# EAGLE board Proto2 (EAGLE 8.5.1), part 1 of 2
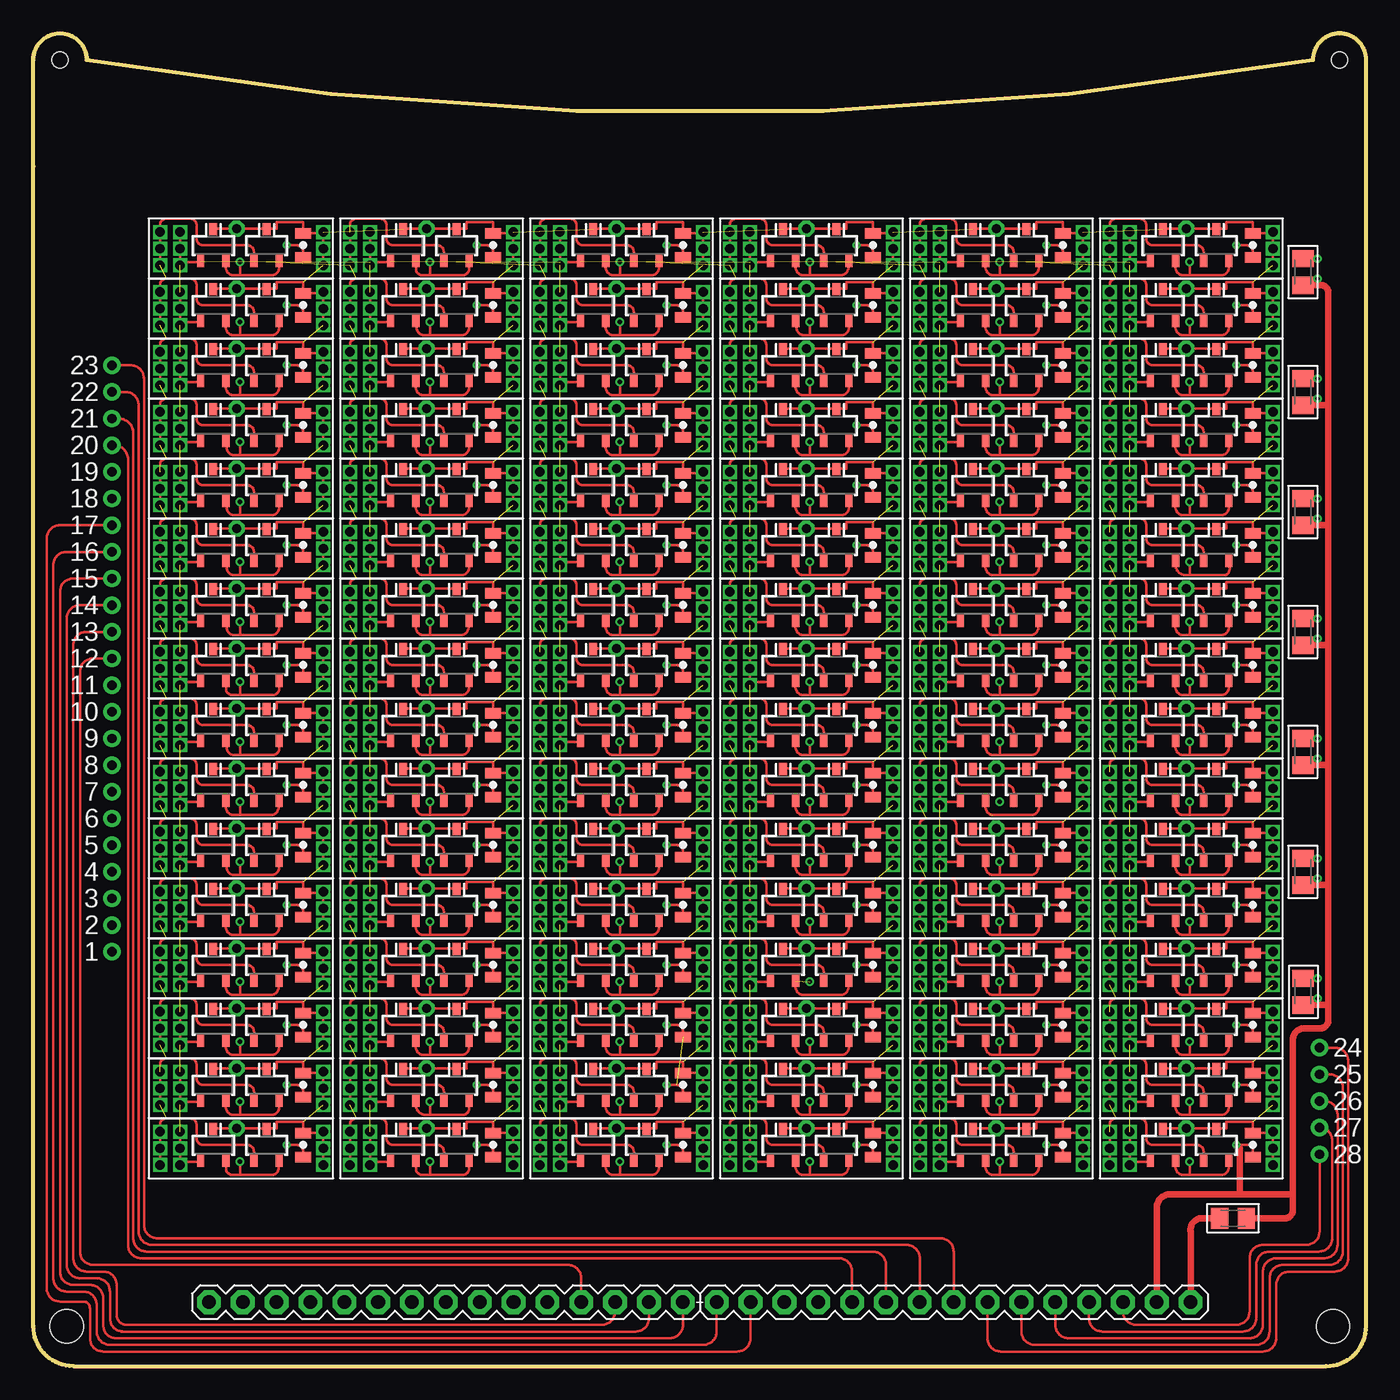
[diagram p1: board, top side]
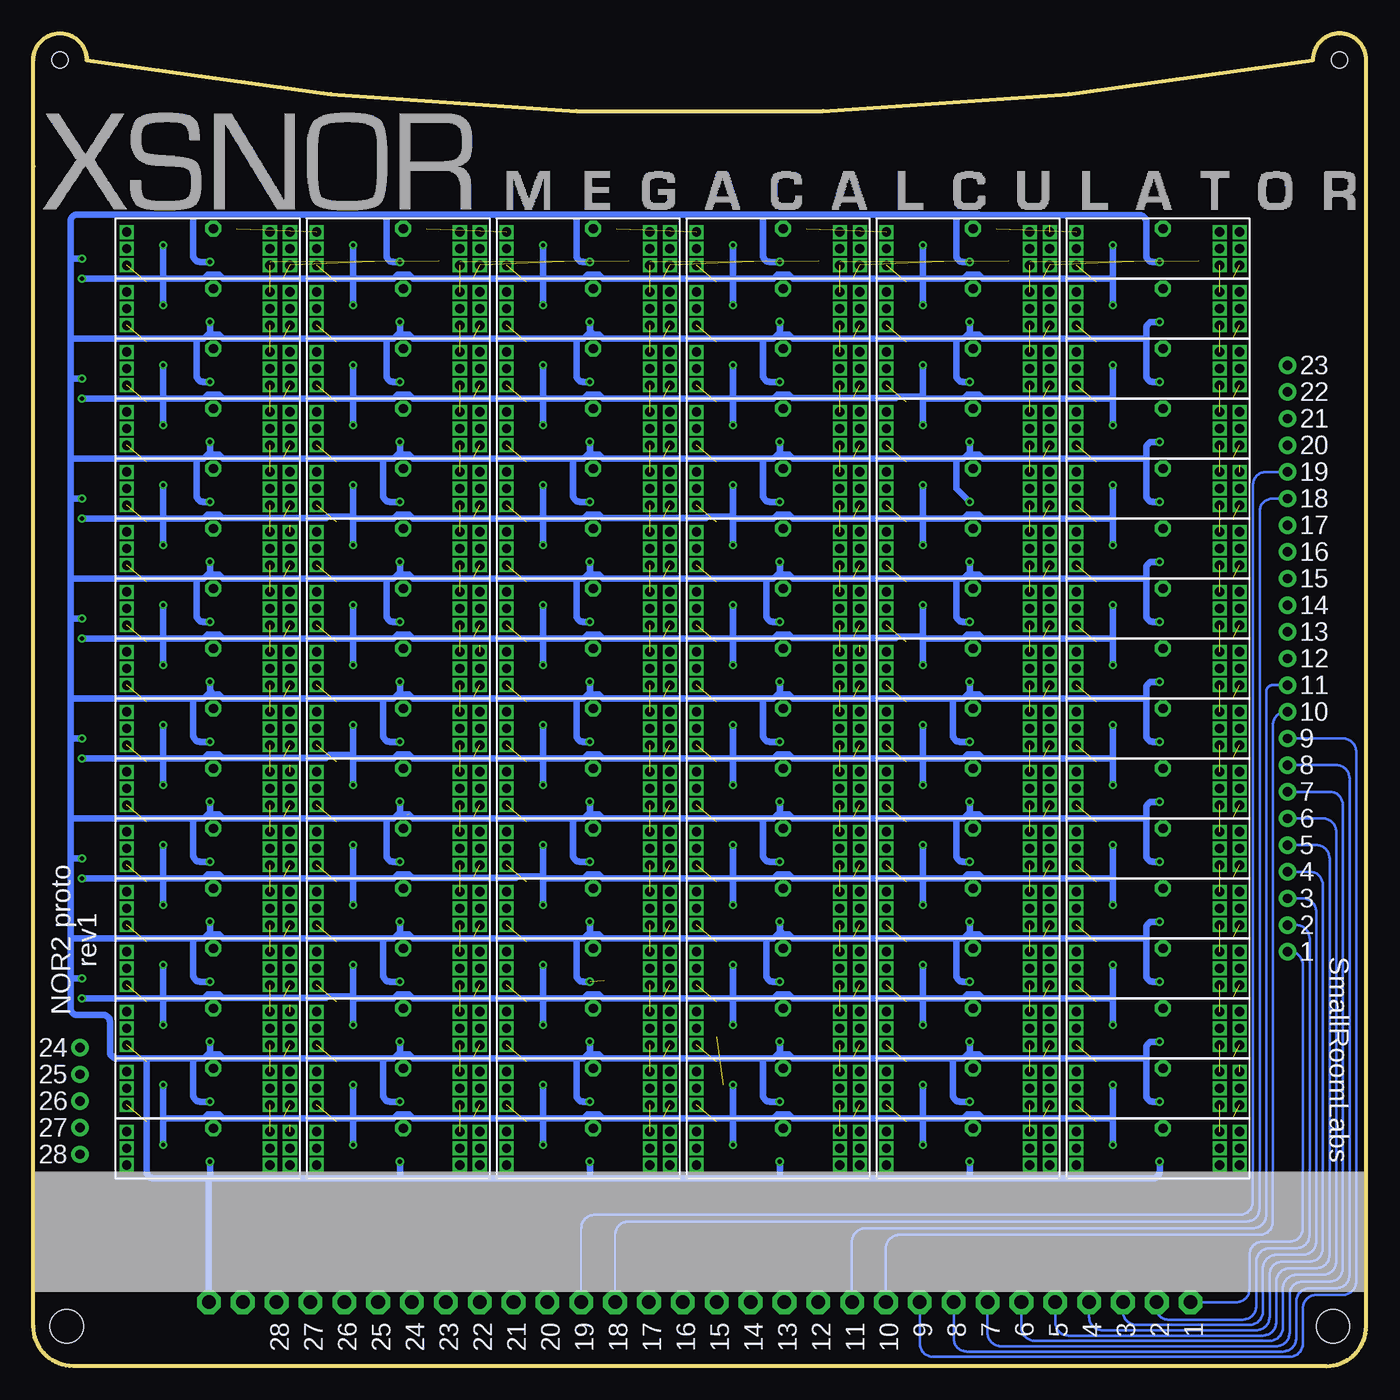
[diagram p2: board, bottom side, seen from below]

Size 100 x 100 mm. Coordinates in mm from the lower left corner, seen from the top.
Outline: 3,0 arc-90 0,3 0,90 0,98 arc-90 2,100 arc-90 4,98 arc20 96,98 arc-90 98,100 arc-90 100,98 100,90 100,3 arc-90 97,0 3,0
Copper layers (1*16): Top 0.035mm / dielectric 1.5mm / Bottom 0.035mm
Design rules "dirt_cheap_dirty_boards.v1": minimum track width 5mil, minimum drill 12mil, track to track 5mil, track to pad 5mil, pad to pad 5mil, via to via 5mil, smd to smd 0mil, copper to edge 10mil, drill to drill 10mil, minimum pad ring 10mil, minimum via ring 6mil, stop-mask expansion 2mil, vias tented up to drill 25mil, thermal gap 10mil
Net classes: 0 default: width 0.2 mm, drill 0.305 mm, clearance 0.2 mm
Holes 2.5 mm at 2.5,3 97.5,3
Holes 1.2 mm at 2,98 98,98

## Footprints (pad centres in the part's own frame; a part is rotated, then mirrored left to right if it is on the bottom)
C0805K = smd 1.3 x 1.6: 1 -1,0; 2 1,0
1X30 = drill 1.016 pad 1.778 octagon: 1 -36.83,0; 2 -34.29,0; 3 -31.75,0; 4 -29.21,0; 5 -26.67,0; 6 -24.13,0; 7 -21.59,0; 8 -19.05,0; 9 -16.51,0; 10 -13.97,0; 11 -11.43,0; 12 -8.89,0; 13 -6.35,0; 14 -3.81,0; 15 -1.27,0; 16 1.27,0; 17 3.81,0; 18 6.35,0; 19 8.89,0; 20 11.43,0; 21 13.97,0; 22 16.51,0; 23 19.05,0; 24 21.59,0; 25 24.13,0; 26 26.67,0; 27 29.21,0; 28 31.75,0; 29 34.29,0; 30 36.83,0
SOT23 = smd 0.6 x 0.9: 1 -0.95,-1.2; 2 0.95,-1.2 | smd 0.65 x 0.9: 3 0,1.2
0805 = smd 0.8 x 1.2: 1 -0.9,0; 2 0.9,0

## Placement (x,y rotation side)
C2  [C0805K]  90,11.1 180 top
C4  [C0805K]  95.25,28.1 90 top
C6  [C0805K]  95.25,37.1 90 top
C8  [C0805K]  95.25,46.1 90 top
C10  [C0805K]  95.25,55.1 90 top
C12  [C0805K]  95.25,64.1 90 top
C14  [C0805K]  95.25,73.1 90 top
C16  [C0805K]  95.25,82.1 90 top
JP2  [1X30]  50,4.8 0 top
Q1  310mA/60V/1.6Ω  [SOT23]  13.5,16.6 0 top
Q2  310mA/60V/1.6Ω  [SOT23]  17.5,16.6 0 top
Q5  310mA/60V/1.6Ω  [SOT23]  13.5,21.1 0 top
Q6  310mA/60V/1.6Ω  [SOT23]  17.5,21.1 0 top
Q9  310mA/60V/1.6Ω  [SOT23]  13.5,25.6 0 top
Q10  310mA/60V/1.6Ω  [SOT23]  17.5,25.6 0 top
Q13  310mA/60V/1.6Ω  [SOT23]  13.5,30.1 0 top
Q14  310mA/60V/1.6Ω  [SOT23]  17.5,30.1 0 top
Q17  310mA/60V/1.6Ω  [SOT23]  13.5,34.6 0 top
Q18  310mA/60V/1.6Ω  [SOT23]  17.5,34.6 0 top
Q21  310mA/60V/1.6Ω  [SOT23]  13.5,39.1 0 top
Q22  310mA/60V/1.6Ω  [SOT23]  17.5,39.1 0 top
Q25  310mA/60V/1.6Ω  [SOT23]  13.5,43.6 0 top
Q26  310mA/60V/1.6Ω  [SOT23]  17.5,43.6 0 top
Q29  310mA/60V/1.6Ω  [SOT23]  13.5,48.1 0 top
Q30  310mA/60V/1.6Ω  [SOT23]  17.5,48.1 0 top
Q33  310mA/60V/1.6Ω  [SOT23]  13.5,52.6 0 top
Q34  310mA/60V/1.6Ω  [SOT23]  17.5,52.6 0 top
Q37  310mA/60V/1.6Ω  [SOT23]  13.5,57.1 0 top
Q38  310mA/60V/1.6Ω  [SOT23]  17.5,57.1 0 top
Q41  310mA/60V/1.6Ω  [SOT23]  13.5,61.6 0 top
Q42  310mA/60V/1.6Ω  [SOT23]  17.5,61.6 0 top
Q45  310mA/60V/1.6Ω  [SOT23]  13.5,66.1 0 top
Q46  310mA/60V/1.6Ω  [SOT23]  17.5,66.1 0 top
Q49  310mA/60V/1.6Ω  [SOT23]  13.5,70.6 0 top
Q50  310mA/60V/1.6Ω  [SOT23]  17.5,70.6 0 top
Q53  310mA/60V/1.6Ω  [SOT23]  13.5,75.1 0 top
Q54  310mA/60V/1.6Ω  [SOT23]  17.5,75.1 0 top
Q57  310mA/60V/1.6Ω  [SOT23]  13.5,79.6 0 top
Q58  310mA/60V/1.6Ω  [SOT23]  17.5,79.6 0 top
Q61  310mA/60V/1.6Ω  [SOT23]  13.5,84.1 0 top
Q62  310mA/60V/1.6Ω  [SOT23]  17.5,84.1 0 top
Q65  310mA/60V/1.6Ω  [SOT23]  27.75,16.6 0 top
Q66  310mA/60V/1.6Ω  [SOT23]  31.75,16.6 0 top
Q67  310mA/60V/1.6Ω  [SOT23]  27.75,21.1 0 top
Q68  310mA/60V/1.6Ω  [SOT23]  31.75,21.1 0 top
Q69  310mA/60V/1.6Ω  [SOT23]  27.75,25.6 0 top
Q70  310mA/60V/1.6Ω  [SOT23]  31.75,25.6 0 top
Q71  310mA/60V/1.6Ω  [SOT23]  27.75,30.1 0 top
Q72  310mA/60V/1.6Ω  [SOT23]  31.75,30.1 0 top
Q73  310mA/60V/1.6Ω  [SOT23]  27.75,34.6 0 top
Q74  310mA/60V/1.6Ω  [SOT23]  31.75,34.6 0 top
Q75  310mA/60V/1.6Ω  [SOT23]  27.75,39.1 0 top
Q76  310mA/60V/1.6Ω  [SOT23]  31.75,39.1 0 top
Q77  310mA/60V/1.6Ω  [SOT23]  27.75,43.6 0 top
Q78  310mA/60V/1.6Ω  [SOT23]  31.75,43.6 0 top
Q79  310mA/60V/1.6Ω  [SOT23]  27.75,48.1 0 top
Q80  310mA/60V/1.6Ω  [SOT23]  31.75,48.1 0 top
Q81  310mA/60V/1.6Ω  [SOT23]  27.75,52.6 0 top
Q82  310mA/60V/1.6Ω  [SOT23]  31.75,52.6 0 top
Q83  310mA/60V/1.6Ω  [SOT23]  27.75,57.1 0 top
Q84  310mA/60V/1.6Ω  [SOT23]  31.75,57.1 0 top
Q85  310mA/60V/1.6Ω  [SOT23]  27.75,61.6 0 top
Q86  310mA/60V/1.6Ω  [SOT23]  31.75,61.6 0 top
Q87  310mA/60V/1.6Ω  [SOT23]  27.75,66.1 0 top
Q88  310mA/60V/1.6Ω  [SOT23]  31.75,66.1 0 top
Q89  310mA/60V/1.6Ω  [SOT23]  27.75,70.6 0 top
Q90  310mA/60V/1.6Ω  [SOT23]  31.75,70.6 0 top
Q91  310mA/60V/1.6Ω  [SOT23]  27.75,75.1 0 top
Q92  310mA/60V/1.6Ω  [SOT23]  31.75,75.1 0 top
Q93  310mA/60V/1.6Ω  [SOT23]  27.75,79.6 0 top
Q94  310mA/60V/1.6Ω  [SOT23]  31.75,79.6 0 top
Q95  310mA/60V/1.6Ω  [SOT23]  27.75,84.1 0 top
Q96  310mA/60V/1.6Ω  [SOT23]  31.75,84.1 0 top
Q129  310mA/60V/1.6Ω  [SOT23]  42,16.6 0 top
Q130  310mA/60V/1.6Ω  [SOT23]  46,16.6 0 top
Q131  310mA/60V/1.6Ω  [SOT23]  42,21.1 0 top
Q132  310mA/60V/1.6Ω  [SOT23]  46,21.1 0 top
Q133  310mA/60V/1.6Ω  [SOT23]  42,25.6 0 top
Q134  310mA/60V/1.6Ω  [SOT23]  46,25.6 0 top
Q135  310mA/60V/1.6Ω  [SOT23]  42,30.1 0 top
Q136  310mA/60V/1.6Ω  [SOT23]  46,30.1 0 top
Q137  310mA/60V/1.6Ω  [SOT23]  42,34.6 0 top
Q138  310mA/60V/1.6Ω  [SOT23]  46,34.6 0 top
Q139  310mA/60V/1.6Ω  [SOT23]  42,39.1 0 top
Q140  310mA/60V/1.6Ω  [SOT23]  46,39.1 0 top
Q141  310mA/60V/1.6Ω  [SOT23]  42,43.6 0 top
Q142  310mA/60V/1.6Ω  [SOT23]  46,43.6 0 top
Q143  310mA/60V/1.6Ω  [SOT23]  42,48.1 0 top
Q144  310mA/60V/1.6Ω  [SOT23]  46,48.1 0 top
Q145  310mA/60V/1.6Ω  [SOT23]  42,52.6 0 top
Q146  310mA/60V/1.6Ω  [SOT23]  46,52.6 0 top
Q147  310mA/60V/1.6Ω  [SOT23]  42,57.1 0 top
Q148  310mA/60V/1.6Ω  [SOT23]  46,57.1 0 top
Q149  310mA/60V/1.6Ω  [SOT23]  42,61.6 0 top
Q150  310mA/60V/1.6Ω  [SOT23]  46,61.6 0 top
Q151  310mA/60V/1.6Ω  [SOT23]  42,66.1 0 top
Q152  310mA/60V/1.6Ω  [SOT23]  46,66.1 0 top
Q153  310mA/60V/1.6Ω  [SOT23]  42,70.6 0 top
Q154  310mA/60V/1.6Ω  [SOT23]  46,70.6 0 top
Q155  310mA/60V/1.6Ω  [SOT23]  42,75.1 0 top
Q156  310mA/60V/1.6Ω  [SOT23]  46,75.1 0 top
Q157  310mA/60V/1.6Ω  [SOT23]  42,79.6 0 top
Q158  310mA/60V/1.6Ω  [SOT23]  46,79.6 0 top
Q159  310mA/60V/1.6Ω  [SOT23]  42,84.1 0 top
Q160  310mA/60V/1.6Ω  [SOT23]  46,84.1 0 top
Q193  310mA/60V/1.6Ω  [SOT23]  56.25,16.6 0 top
Q194  310mA/60V/1.6Ω  [SOT23]  60.25,16.6 0 top
Q195  310mA/60V/1.6Ω  [SOT23]  56.25,21.1 0 top
Q196  310mA/60V/1.6Ω  [SOT23]  60.25,21.1 0 top
Q197  310mA/60V/1.6Ω  [SOT23]  56.25,25.6 0 top
Q198  310mA/60V/1.6Ω  [SOT23]  60.25,25.6 0 top
Q199  310mA/60V/1.6Ω  [SOT23]  56.25,30.1 0 top
Q200  310mA/60V/1.6Ω  [SOT23]  60.25,30.1 0 top
Q201  310mA/60V/1.6Ω  [SOT23]  56.25,34.6 0 top
Q202  310mA/60V/1.6Ω  [SOT23]  60.25,34.6 0 top
Q203  310mA/60V/1.6Ω  [SOT23]  56.25,39.1 0 top
Q204  310mA/60V/1.6Ω  [SOT23]  60.25,39.1 0 top
Q205  310mA/60V/1.6Ω  [SOT23]  56.25,43.6 0 top
Q206  310mA/60V/1.6Ω  [SOT23]  60.25,43.6 0 top
Q207  310mA/60V/1.6Ω  [SOT23]  56.25,48.1 0 top
Q208  310mA/60V/1.6Ω  [SOT23]  60.25,48.1 0 top
Q209  310mA/60V/1.6Ω  [SOT23]  56.25,52.6 0 top
Q210  310mA/60V/1.6Ω  [SOT23]  60.25,52.6 0 top
Q211  310mA/60V/1.6Ω  [SOT23]  56.25,57.1 0 top
Q212  310mA/60V/1.6Ω  [SOT23]  60.25,57.1 0 top
Q213  310mA/60V/1.6Ω  [SOT23]  56.25,61.6 0 top
Q214  310mA/60V/1.6Ω  [SOT23]  60.25,61.6 0 top
Q215  310mA/60V/1.6Ω  [SOT23]  56.25,66.1 0 top
Q216  310mA/60V/1.6Ω  [SOT23]  60.25,66.1 0 top
Q217  310mA/60V/1.6Ω  [SOT23]  56.25,70.6 0 top
Q218  310mA/60V/1.6Ω  [SOT23]  60.25,70.6 0 top
Q219  310mA/60V/1.6Ω  [SOT23]  56.25,75.1 0 top
Q220  310mA/60V/1.6Ω  [SOT23]  60.25,75.1 0 top
Q221  310mA/60V/1.6Ω  [SOT23]  56.25,79.6 0 top
Q222  310mA/60V/1.6Ω  [SOT23]  60.25,79.6 0 top
Q223  310mA/60V/1.6Ω  [SOT23]  56.25,84.1 0 top
Q224  310mA/60V/1.6Ω  [SOT23]  60.25,84.1 0 top
Q257  310mA/60V/1.6Ω  [SOT23]  70.5,16.6 0 top
Q258  310mA/60V/1.6Ω  [SOT23]  74.5,16.6 0 top
Q259  310mA/60V/1.6Ω  [SOT23]  70.5,21.1 0 top
Q260  310mA/60V/1.6Ω  [SOT23]  74.5,21.1 0 top
Q261  310mA/60V/1.6Ω  [SOT23]  70.5,25.6 0 top
Q262  310mA/60V/1.6Ω  [SOT23]  74.5,25.6 0 top
Q263  310mA/60V/1.6Ω  [SOT23]  70.5,30.1 0 top
Q264  310mA/60V/1.6Ω  [SOT23]  74.5,30.1 0 top
Q265  310mA/60V/1.6Ω  [SOT23]  70.5,34.6 0 top
Q266  310mA/60V/1.6Ω  [SOT23]  74.5,34.6 0 top
Q267  310mA/60V/1.6Ω  [SOT23]  70.5,39.1 0 top
Q268  310mA/60V/1.6Ω  [SOT23]  74.5,39.1 0 top
Q269  310mA/60V/1.6Ω  [SOT23]  70.5,43.6 0 top
Q270  310mA/60V/1.6Ω  [SOT23]  74.5,43.6 0 top
Q271  310mA/60V/1.6Ω  [SOT23]  70.5,48.1 0 top
Q272  310mA/60V/1.6Ω  [SOT23]  74.5,48.1 0 top
Q273  310mA/60V/1.6Ω  [SOT23]  70.5,52.6 0 top
Q274  310mA/60V/1.6Ω  [SOT23]  74.5,52.6 0 top
Q275  310mA/60V/1.6Ω  [SOT23]  70.5,57.1 0 top
Q276  310mA/60V/1.6Ω  [SOT23]  74.5,57.1 0 top
Q277  310mA/60V/1.6Ω  [SOT23]  70.5,61.6 0 top
Q278  310mA/60V/1.6Ω  [SOT23]  74.5,61.6 0 top
Q279  310mA/60V/1.6Ω  [SOT23]  70.5,66.1 0 top
Q280  310mA/60V/1.6Ω  [SOT23]  74.5,66.1 0 top
Q281  310mA/60V/1.6Ω  [SOT23]  70.5,70.6 0 top
Q282  310mA/60V/1.6Ω  [SOT23]  74.5,70.6 0 top
Q283  310mA/60V/1.6Ω  [SOT23]  70.5,75.1 0 top
Q284  310mA/60V/1.6Ω  [SOT23]  74.5,75.1 0 top
Q285  310mA/60V/1.6Ω  [SOT23]  70.5,79.6 0 top
Q286  310mA/60V/1.6Ω  [SOT23]  74.5,79.6 0 top
Q287  310mA/60V/1.6Ω  [SOT23]  70.5,84.1 0 top
Q288  310mA/60V/1.6Ω  [SOT23]  74.5,84.1 0 top
Q321  310mA/60V/1.6Ω  [SOT23]  84.75,16.6 0 top
Q322  310mA/60V/1.6Ω  [SOT23]  88.75,16.6 0 top
Q323  310mA/60V/1.6Ω  [SOT23]  84.75,21.1 0 top
Q324  310mA/60V/1.6Ω  [SOT23]  88.75,21.1 0 top
Q325  310mA/60V/1.6Ω  [SOT23]  84.75,25.6 0 top
Q326  310mA/60V/1.6Ω  [SOT23]  88.75,25.6 0 top
Q327  310mA/60V/1.6Ω  [SOT23]  84.75,30.1 0 top
Q328  310mA/60V/1.6Ω  [SOT23]  88.75,30.1 0 top
Q329  310mA/60V/1.6Ω  [SOT23]  84.75,34.6 0 top
Q330  310mA/60V/1.6Ω  [SOT23]  88.75,34.6 0 top
Q331  310mA/60V/1.6Ω  [SOT23]  84.75,39.1 0 top
Q332  310mA/60V/1.6Ω  [SOT23]  88.75,39.1 0 top
Q333  310mA/60V/1.6Ω  [SOT23]  84.75,43.6 0 top
Q334  310mA/60V/1.6Ω  [SOT23]  88.75,43.6 0 top
Q335  310mA/60V/1.6Ω  [SOT23]  84.75,48.1 0 top
Q336  310mA/60V/1.6Ω  [SOT23]  88.75,48.1 0 top
Q337  310mA/60V/1.6Ω  [SOT23]  84.75,52.6 0 top
Q338  310mA/60V/1.6Ω  [SOT23]  88.75,52.6 0 top
Q339  310mA/60V/1.6Ω  [SOT23]  84.75,57.1 0 top
Q340  310mA/60V/1.6Ω  [SOT23]  88.75,57.1 0 top
Q341  310mA/60V/1.6Ω  [SOT23]  84.75,61.6 0 top
Q342  310mA/60V/1.6Ω  [SOT23]  88.75,61.6 0 top
Q343  310mA/60V/1.6Ω  [SOT23]  84.75,66.1 0 top
Q344  310mA/60V/1.6Ω  [SOT23]  88.75,66.1 0 top
Q345  310mA/60V/1.6Ω  [SOT23]  84.75,70.6 0 top
Q346  310mA/60V/1.6Ω  [SOT23]  88.75,70.6 0 top
Q347  310mA/60V/1.6Ω  [SOT23]  84.75,75.1 0 top
Q348  310mA/60V/1.6Ω  [SOT23]  88.75,75.1 0 top
Q349  310mA/60V/1.6Ω  [SOT23]  84.75,79.6 0 top
Q350  310mA/60V/1.6Ω  [SOT23]  88.75,79.6 0 top
Q351  310mA/60V/1.6Ω  [SOT23]  84.75,84.1 0 top
Q352  310mA/60V/1.6Ω  [SOT23]  88.75,84.1 0 top
R1  [0805]  20.25,16.6 90 top
R3  [0805]  20.25,21.1 90 top
R5  [0805]  20.25,25.6 90 top
R7  [0805]  20.25,30.1 90 top
R9  [0805]  20.25,34.6 90 top
R11  [0805]  20.25,39.1 90 top
R13  [0805]  20.25,43.6 90 top
R15  [0805]  20.25,48.1 90 top
R17  [0805]  20.25,52.6 90 top
R19  [0805]  20.25,57.1 90 top
R21  [0805]  20.25,61.6 90 top
R23  [0805]  20.25,66.1 90 top
R25  [0805]  20.25,70.6 90 top
R27  [0805]  20.25,75.1 90 top
R29  [0805]  20.25,79.6 90 top
R31  [0805]  20.25,84.1 90 top
R33  [0805]  34.5,16.6 90 top
R34  [0805]  34.5,21.1 90 top
R35  [0805]  34.5,25.6 90 top
R36  [0805]  34.5,30.1 90 top
R37  [0805]  34.5,34.6 90 top
R38  [0805]  34.5,39.1 90 top
R39  [0805]  34.5,43.6 90 top
R40  [0805]  34.5,48.1 90 top
R41  [0805]  34.5,52.6 90 top
R42  [0805]  34.5,57.1 90 top
R43  [0805]  34.5,61.6 90 top
R44  [0805]  34.5,66.1 90 top
R45  [0805]  34.5,70.6 90 top
R46  [0805]  34.5,75.1 90 top
R47  [0805]  34.5,79.6 90 top
R48  [0805]  34.5,84.1 90 top
R65  [0805]  48.75,16.6 90 top
R66  [0805]  48.75,21.1 90 top
R67  [0805]  48.75,25.6 90 top
R68  [0805]  48.75,30.1 90 top
R69  [0805]  48.75,34.6 90 top
R70  [0805]  48.75,39.1 90 top
R71  [0805]  48.75,43.6 90 top
R72  [0805]  48.75,48.1 90 top
R73  [0805]  48.75,52.6 90 top
R74  [0805]  48.75,57.1 90 top
R75  [0805]  48.75,61.6 90 top
R76  [0805]  48.75,66.1 90 top
R77  [0805]  48.75,70.6 90 top
R78  [0805]  48.75,75.1 90 top
R79  [0805]  48.75,79.6 90 top
R80  [0805]  48.75,84.1 90 top
R97  [0805]  63,16.6 90 top
R98  [0805]  63,21.1 90 top
R99  [0805]  63,25.6 90 top
R100  [0805]  63,30.1 90 top
R101  [0805]  63,34.6 90 top
R102  [0805]  63,39.1 90 top
R103  [0805]  63,43.6 90 top
R104  [0805]  63,48.1 90 top
R105  [0805]  63,52.6 90 top
R106  [0805]  63,57.1 90 top
R107  [0805]  63,61.6 90 top
R108  [0805]  63,66.1 90 top
R109  [0805]  63,70.6 90 top
R110  [0805]  63,75.1 90 top
R111  [0805]  63,79.6 90 top
R112  [0805]  63,84.1 90 top
R129  [0805]  77.25,16.6 90 top
R130  [0805]  77.25,21.1 90 top
R131  [0805]  77.25,25.6 90 top
R132  [0805]  77.25,30.1 90 top
R133  [0805]  77.25,34.6 90 top
R134  [0805]  77.25,39.1 90 top
R135  [0805]  77.25,43.6 90 top
R136  [0805]  77.25,48.1 90 top
R137  [0805]  77.25,52.6 90 top
R138  [0805]  77.25,57.1 90 top
R139  [0805]  77.25,61.6 90 top
R140  [0805]  77.25,66.1 90 top
R141  [0805]  77.25,70.6 90 top
R142  [0805]  77.25,75.1 90 top
R143  [0805]  77.25,79.6 90 top
R144  [0805]  77.25,84.1 90 top
R161  [0805]  91.5,16.6 90 top
R162  [0805]  91.5,21.1 90 top
R163  [0805]  91.5,25.6 90 top
R164  [0805]  91.5,30.1 90 top
R165  [0805]  91.5,34.6 90 top
R166  [0805]  91.5,39.1 90 top
R167  [0805]  91.5,43.6 90 top
R168  [0805]  91.5,48.1 90 top
R169  [0805]  91.5,52.6 90 top
R170  [0805]  91.5,57.1 90 top
R171  [0805]  91.5,61.6 90 top
R172  [0805]  91.5,66.1 90 top
R173  [0805]  91.5,70.6 90 top
R174  [0805]  91.5,75.1 90 top
R175  [0805]  91.5,79.6 90 top
R176  [0805]  91.5,84.1 90 top

## Tracks (layer width: path | path; a pad name or v marks a point on that pad's centre or on a via)
GND  (via drill 0.3)  (2 unrouted)
  Top 0.2: Q2.2 18.4,15.35 18.4,14.85 arc-90 17.9,14.35 15.5,14.35 | Q14.2 18.4,28.85 18.4,28.6 arc-90 17.9,27.85 15.5,27.85 | Q21.2 14.5,37.9 14.5,37.6 arc90 15,36.85 15.5,36.85 | Q26.2 18.4,42.35 18.4,42.1 arc-90 17.9,41.35 15.5,41.35 | Q29.2 14.5,46.9 14.5,46.6 arc90 15,45.85 15.5,45.85 | Q37.2 14.5,55.9 14.5,55.6 arc90 15,54.85 15.5,54.85 | Q41.2 14.5,60.4 14.5,60.1 arc90 15,59.35 15.5,59.35 | Q45.2 14.5,64.9 14.5,64.6 arc90 15,63.85 15.5,63.85 | Q49.2 14.5,69.4 14.5,69.1 arc90 15,68.35 15.5,68.35 | Q72.2 32.65,28.85 32.65,28.6 arc-90 32.15,27.85 29.75,27.85 | Q84.2 32.65,55.85 32.65,55.6 arc-90 32.15,54.85 29.75,54.85 | Q93.2 28.75,78.4 28.75,78.1 arc90 29.25,77.35 29.75,77.35 | Q136.2 46.9,28.85 46.9,28.6 arc-90 46.4,27.85 44,27.85 | Q194.2 61.15,15.35 61.15,15.1 arc-90 60.65,14.35 58.25,14.35 | Q200.2 61.15,28.85 61.15,28.6 arc-90 60.65,27.85 57.7,27.85 arc-90 57.2,28.6 Q199.2 | Q221.2 57.25,78.4 57.25,78.1 arc90 57.75,77.35 58.25,77.35 | Q224.2 61.15,82.85 61.15,82.6 arc-90 60.65,81.85 58.25,81.85 | Q268.2 75.4,37.85 75.4,37.6 arc-90 74.9,36.85 72.5,36.85 | Q276.2 75.4,55.85 75.4,55.6 arc-90 74.9,54.85 72.5,54.85 | Q280.2 75.4,64.85 75.4,64.6 arc-90 74.9,63.85 72.5,63.85 | Q5.2 14.45,19.6 arc90 14.95,18.85 15.5,18.85 | Q6.2 18.45,19.6 arc-90 17.95,18.85 15.5,18.85 | Q9.2 14.45,24.1 arc90 14.95,23.35 15.5,23.35 | Q10.2 18.45,24.1 arc-90 17.95,23.35 15.5,23.35 | Q13.2 14.45,28.6 arc90 14.95,27.85 15.5,27.85 | Q17.2 14.45,33.1 arc90 14.95,32.35 15.5,32.35 | Q18.2 18.45,33.1 arc-90 17.95,32.35 15.5,32.35 | Q22.2 18.45,37.6 arc-90 17.95,36.85 15.5,36.85 | Q25.2 14.45,42.1 arc90 14.95,41.35 15.5,41.35
  Top 0.2: Q30.2 18.45,46.35 arc-90 17.95,45.85 15.5,45.85 | Q34.2 18.45,50.85 arc-90 17.95,50.35 15.5,50.35 | Q33.2 14.45,50.85 arc90 14.95,50.35 15.5,50.35 | Q1.2 14.45,14.85 arc90 14.95,14.35 15.5,14.35 | Q38.2 18.45,55.6 arc-90 17.95,54.85 15.5,54.85 | Q42.2 18.45,60.1 arc-90 17.95,59.35 15.5,59.35 | Q46.2 18.45,64.6 arc-90 17.95,63.85 15.5,63.85 | Q50.2 18.45,69.1 arc-90 17.95,68.35 15.5,68.35 | Q53.2 14.45,73.6 arc90 14.95,72.85 15.5,72.85 | Q54.2 18.45,73.6 arc-90 17.95,72.85 15.5,72.85 | Q57.2 14.45,78.1 arc90 14.95,77.35 15.5,77.35 | Q58.2 18.45,78.1 arc-90 17.95,77.35 15.5,77.35 | Q62.2 18.45,82.6 arc-90 17.95,81.85 15.5,81.85 | Q61.2 14.45,82.6 arc90 14.95,81.85 15.5,81.85 | 28.7,82.6 Q95.2 28.7,82.35 arc90 29.2,81.85 29.75,81.85 | Q94.2 32.7,78.1 arc-90 32.2,77.35 29.75,77.35 | Q91.2 28.7,73.6 arc90 29.2,72.85 29.75,72.85 | Q92.2 32.7,73.6 arc-90 32.2,72.85 29.75,72.85 | Q90.2 32.7,69.1 arc-90 32.2,68.35 29.75,68.35 | Q89.2 28.7,69.1 arc90 29.2,68.35 29.75,68.35 | Q87.2 28.7,64.6 arc90 29.2,63.85 29.75,63.85 | Q88.2 32.7,64.6 arc-90 32.2,63.85 29.75,63.85 | Q86.2 32.7,60.1 arc-90 32.2,59.35 29.75,59.35 | Q85.2 28.7,60.1 arc90 29.2,59.35 29.75,59.35 | Q83.2 28.7,55.6 arc90 29.2,54.85 29.75,54.85 | Q81.2 28.7,51.1 arc90 29.2,50.35 29.75,50.35 | Q82.2 32.7,51.1 arc-90 32.2,50.35 29.75,50.35 | Q79.2 28.7,46.6 arc90 29.2,45.85 29.75,45.85 | Q80.2 32.7,46.6 arc-90 32.2,45.85 29.75,45.85 | Q77.2 28.7,42.1 arc90 29.2,41.35 29.75,41.35 | Q78.2 32.7,42.1 arc-90 32.2,41.35 29.75,41.35 | Q75.2 28.7,37.6 arc90 29.2,36.85 29.75,36.85 | Q76.2 32.7,37.6 arc-90 32.2,36.85 29.75,36.85 | Q73.2 28.7,33.1 arc90 29.2,32.35 29.75,32.35
  Top 0.2: Q74.2 32.7,33.1 arc-90 32.2,32.35 29.75,32.35 | Q71.2 28.7,28.6 arc90 29.2,27.85 29.75,27.85 | Q70.2 32.7,24.1 arc-90 32.2,23.35 29.75,23.35 | Q69.2 28.7,24.1 arc90 29.2,23.35 29.75,23.35 | Q67.2 28.7,19.6 arc90 29.45,18.85 29.75,18.85 | 29.75,18.85 32.2,18.85 arc90 32.7,19.35 Q68.2 | Q66.2 32.7,14.85 arc-90 32.2,14.35 29.75,14.35 | Q65.2 28.7,14.85 arc90 29.2,14.35 29.75,14.35 | 29.75,81.85 32.2,81.85 arc90 32.7,82.35 Q96.2 | Q159.2 42.95,82.6 arc90 43.45,81.85 44,81.85 | Q160.2 46.95,82.6 arc-90 46.45,81.85 44,81.85 | Q157.2 42.95,78.1 arc90 43.45,77.35 44,77.35 | Q158.2 46.95,78.1 arc-90 46.45,77.35 44,77.35 | Q155.2 42.95,73.6 arc90 43.45,72.85 44,72.85 | Q156.2 46.95,73.6 arc-90 46.45,72.85 44,72.85 | Q154.2 46.95,69.1 arc-90 46.45,68.35 44,68.35 | Q153.2 42.95,69.1 arc90 43.45,68.35 44,68.35 | Q151.2 42.95,64.6 arc90 43.45,63.85 44,63.85 | Q152.2 46.95,64.6 arc-90 46.45,63.85 44,63.85 | Q149.2 42.95,60.1 arc90 43.45,59.35 44,59.35 | Q150.2 46.95,60.1 arc-90 46.45,59.35 44,59.35 | Q147.2 42.95,55.6 arc90 43.45,54.85 44,54.85 | Q148.2 46.95,55.6 arc-90 46.45,54.85 44,54.85 | Q145.2 42.95,51.1 arc90 43.45,50.35 44,50.35 | Q146.2 46.95,51.1 arc-90 46.45,50.35 44,50.35 | Q143.2 42.95,46.6 arc90 43.45,45.85 44,45.85 | Q144.2 46.95,46.6 arc-90 46.45,45.85 44,45.85 | Q141.2 42.95,42.1 arc90 43.45,41.35 44,41.35 | Q142.2 46.95,42.1 arc-90 46.45,41.35 44,41.35 | Q139.2 42.95,37.6 arc90 43.45,36.85 44,36.85 | Q140.2 46.95,37.6 arc-90 46.45,36.85 44,36.85 | Q137.2 42.95,33.1 arc90 43.45,32.35 44,32.35 | Q138.2 46.95,33.1 arc-90 46.45,32.35 44,32.35 | Q135.2 42.95,28.6 arc90 43.45,27.85 44,27.85
  Top 0.2: Q133.2 42.95,24.1 arc90 43.45,23.35 44,23.35 | Q134.2 46.95,24.1 arc-90 46.45,23.35 44,23.35 | Q131.2 42.95,19.6 arc90 43.45,18.85 44,18.85 | Q132.2 46.95,19.6 arc-90 46.45,18.85 44,18.85 | Q129.2 42.95,15.1 arc90 43.45,14.35 44,14.35 | Q130.2 46.95,15.1 arc-90 46.45,14.35 44,14.35 | Q223.2 57.2,82.6 arc90 57.7,81.85 58.25,81.85 | Q222.2 61.2,78.1 arc-90 60.7,77.35 58.25,77.35 | Q219.2 57.2,73.6 arc90 57.7,72.85 58.25,72.85 | Q220.2 61.2,73.6 arc-90 60.7,72.85 58.25,72.85 | Q217.2 57.2,69.1 arc90 57.7,68.35 58.25,68.35 | Q218.2 61.2,69.1 arc-90 60.7,68.35 58.25,68.35 | Q215.2 57.2,64.6 arc90 57.7,63.85 58.25,63.85 | Q216.2 61.2,64.6 arc-90 60.7,63.85 58.25,63.85 | Q213.2 57.2,60.1 arc90 57.7,59.35 58.25,59.35 | Q214.2 61.2,60.1 arc-90 60.7,59.35 58.25,59.35 | Q211.2 57.2,55.6 arc90 57.7,54.85 58.25,54.85 | Q212.2 61.2,55.6 arc-90 60.7,54.85 58.25,54.85 | Q209.2 57.2,51.1 arc90 57.7,50.35 58.25,50.35 | Q210.2 61.2,51.1 arc-90 60.7,50.35 58.25,50.35 | Q207.2 57.2,46.6 arc90 57.7,45.85 58.25,45.85 | Q208.2 61.2,46.6 arc-90 60.7,45.85 58.25,45.85 | Q206.2 61.2,42.1 arc-90 60.7,41.35 58.25,41.35 | Q205.2 57.2,42.1 arc90 57.7,41.35 58.25,41.35 | Q203.2 57.2,37.6 arc90 57.7,36.85 58.25,36.85 | Q204.2 61.2,37.6 arc-90 60.7,36.85 58.25,36.85 | Q202.2 61.2,33.1 arc-90 60.7,32.35 58.25,32.35 | Q201.2 57.2,33.1 arc90 57.7,32.35 58.25,32.35 | Q197.2 57.2,24.1 arc90 57.7,23.35 58.25,23.35 | Q198.2 61.2,24.1 arc-90 60.7,23.35 58.25,23.35 | Q195.2 57.2,19.6 arc90 57.7,18.85 58.25,18.85 | Q196.2 61.2,19.6 arc-90 60.7,18.85 58.25,18.85 | Q193.2 57.2,15.1 arc90 57.7,14.35 58.25,14.35 | Q288.2 75.45,82.6 arc-90 74.95,81.85 72.5,81.85
  Top 0.2: Q287.2 71.45,82.6 arc90 71.95,81.85 72.5,81.85 | Q286.2 75.45,78.1 arc-90 74.95,77.35 72.5,77.35 | Q285.2 71.45,78.1 arc90 71.95,77.35 72.5,77.35 | Q283.2 71.45,73.6 arc90 71.95,72.85 72.5,72.85 | Q284.2 75.45,73.6 arc-90 74.95,72.85 72.5,72.85 | Q281.2 71.45,69.1 arc90 71.95,68.35 72.5,68.35 | Q282.2 75.45,69.1 arc-90 74.95,68.35 72.5,68.35 | Q279.2 71.45,64.6 arc90 71.95,63.85 72.5,63.85 | Q278.2 75.45,60.1 arc-90 74.95,59.35 72.5,59.35 | Q277.2 71.45,60.1 arc90 71.95,59.35 72.5,59.35 | Q275.2 71.45,55.6 arc90 71.95,54.85 72.5,54.85 | Q273.2 71.45,51.1 arc90 71.95,50.35 72.5,50.35 | Q274.2 75.45,51.1 arc-90 74.95,50.35 72.5,50.35 | Q272.2 75.45,46.6 arc-90 74.95,45.85 72.5,45.85 | Q271.2 71.45,46.6 arc90 71.95,45.85 72.5,45.85 | Q270.2 75.45,42.1 arc-90 74.95,41.35 71.95,41.35 arc-90 71.45,42.1 Q269.2 | Q267.2 71.45,37.6 arc90 71.95,36.85 72.5,36.85 | Q266.2 75.45,33.1 arc-90 74.95,32.35 72.5,32.35 | Q265.2 71.45,33.1 arc90 71.95,32.35 72.5,32.35 | Q264.2 75.45,28.6 arc-90 74.95,27.85 72.5,27.85 | Q263.2 71.45,28.6 arc90 71.95,27.85 72.5,27.85 | Q262.2 75.45,24.1 arc-90 74.95,23.35 72.5,23.35 | Q261.2 71.45,24.1 arc90 71.95,23.35 72.5,23.35 | Q259.2 71.45,19.6 arc90 71.95,18.85 72.5,18.85 | Q260.2 75.45,19.6 arc-90 74.95,18.85 72.5,18.85 | Q257.2 71.45,15.1 arc90 71.95,14.35 72.5,14.35 | Q258.2 75.45,15.1 arc-90 74.95,14.35 72.5,14.35 | Q351.2 85.7,82.6 arc90 86.2,81.85 86.75,81.85 | Q352.2 89.7,82.6 arc-90 89.2,81.85 86.75,81.85 | Q350.2 89.7,78.1 arc-90 89.2,77.35 86.75,77.35 | Q349.2 85.7,78.1 arc90 86.2,77.35 86.75,77.35 | Q348.2 89.7,73.6 arc-90 89.2,72.85 86.75,72.85
  Top 0.2: Q347.2 85.7,73.6 arc90 86.2,72.85 86.75,72.85 | Q345.2 85.7,69.1 arc90 86.2,68.35 86.75,68.35 | Q346.2 89.7,69.1 arc-90 89.2,68.35 86.75,68.35 | Q343.2 85.7,64.6 arc90 86.2,63.85 86.75,63.85 | Q344.2 89.7,64.6 arc-90 89.2,63.85 86.75,63.85 | Q342.2 89.7,60.1 arc-90 89.45,59.35 86.75,59.35 | Q341.2 85.7,60.1 arc90 86.45,59.35 86.75,59.35 | Q339.2 85.7,55.6 arc90 86.2,54.85 86.75,54.85 | Q340.2 89.7,55.6 arc-90 89.2,54.85 86.75,54.85 | Q338.2 89.7,51.1 arc-90 89.2,50.35 86.75,50.35 | Q337.2 85.7,51.1 arc90 86.2,50.35 86.75,50.35 | Q335.2 85.7,46.6 arc90 86.2,45.85 86.75,45.85 | Q336.2 89.7,46.6 arc-90 89.2,45.85 86.75,45.85 | Q334.2 89.7,42.1 arc-90 89.2,41.35 86.75,41.35 | Q333.2 85.7,42.1 arc90 86.2,41.35 86.75,41.35 | Q332.2 89.7,37.6 arc-90 89.2,36.85 86.75,36.85 | Q331.2 85.7,37.6 arc90 86.2,36.85 86.75,36.85 | Q329.2 85.7,33.1 arc90 86.2,32.35 86.75,32.35 | Q330.2 89.7,33.1 arc-90 89.2,32.35 86.75,32.35 | Q328.2 89.7,28.6 arc-90 89.2,27.85 86.75,27.85 | Q327.2 85.7,28.6 arc90 86.2,27.85 86.75,27.85 | Q325.2 85.7,24.1 arc90 86.2,23.35 86.75,23.35 | Q326.2 89.7,24.1 arc-90 89.2,23.35 86.75,23.35 | Q324.2 89.7,19.6 arc-90 89.2,18.85 86.75,18.85 | Q323.2 85.7,19.6 arc90 86.2,18.85 86.75,18.85 | Q322.2 89.7,15.1 arc-90 89.2,14.35 86.75,14.35 | Q321.2 85.7,15.1 arc90 86.2,14.35 86.75,14.35 | v15.5,82.85 15.5,81.85 | v15.5,78.35 15.5,77.35 | v15.5,73.85 15.5,72.85 | v15.5,69.35 15.5,68.35 | v15.5,64.85 15.5,63.85 | v15.5,60.35 15.5,59.35 | v15.5,55.85 15.5,54.85 | v15.5,51.35 15.5,50.35 | v15.5,46.85 15.5,45.85 | v15.5,42.35 15.5,41.35 | v15.5,37.85 15.5,36.85 | v15.5,33.35 15.5,32.35 | v15.5,28.85 15.5,27.85
  Top 0.2: v15.5,24.35 15.5,23.35 | v15.5,19.85 15.5,18.85 | v15.5,15.35 15.5,14.35 | v29.75,15.35 29.75,14.35 | v29.75,19.85 29.75,18.85 | v29.75,28.85 29.75,27.85 | v29.75,24.35 29.75,23.35 | v29.75,33.35 29.75,32.35 | v29.75,37.85 29.75,36.85 | v29.75,46.85 29.75,45.85 | v29.75,42.35 29.75,41.35 | v29.75,55.85 29.75,54.85 | v29.75,51.35 29.75,50.35 | v29.75,60.35 29.75,59.35 | v29.75,64.85 29.75,63.85 | v29.75,73.85 29.75,72.85 | v29.75,69.35 29.75,68.35 | v29.75,82.85 29.75,81.85 | v29.75,78.35 29.75,77.35 | v44,82.85 44,81.85 | v44,78.35 44,77.35 | v44,73.85 44,72.85 | v44,69.35 44,68.35 | v44,64.85 44,63.85 | v44,60.35 44,59.35 | v44,55.85 44,54.85 | v44,51.35 44,50.35 | v44,46.85 44,45.85 | v44,42.35 44,41.35 | v44,37.85 44,36.85 | v44,33.35 44,32.35 | v44,28.85 44,27.85 | v44,24.35 44,23.35 | v44,19.85 44,18.85 | v44,15.35 44,14.35 | v58.25,15.35 58.25,14.35 | v58.25,19.85 58.25,18.85 | v58.25,24.35 58.25,23.35 | v58.25,33.35 58.25,32.35 | v58.25,37.85 58.25,36.85 | v58.25,42.35 58.25,41.35 | v58.25,46.85 58.25,45.85 | v58.25,51.35 58.25,50.35 | v58.25,64.85 58.25,63.85 | v58.25,60.35 58.25,59.35 | v58.25,55.85 58.25,54.85 | v58.25,73.85 58.25,72.85 | v58.25,69.35 58.25,68.35 | v58.25,78.35 58.25,77.35 | v58.25,82.85 58.25,81.85 | v72.5,82.85 72.5,81.85 | v72.5,78.35 72.5,77.35 | v72.5,73.85 72.5,72.85 | v72.5,69.35 72.5,68.35 | v72.5,64.85 72.5,63.85 | v72.5,60.35 72.5,59.35 | v72.5,55.85 72.5,54.85 | v72.5,51.35 72.5,50.35 | v72.5,46.85 72.5,45.85 | v72.5,37.85 72.5,36.85 | v72.5,33.35 72.5,32.35 | v72.5,28.85 72.5,27.85 | v72.5,24.35 72.5,23.35 | v72.5,19.85 72.5,18.85 | v72.5,15.35 72.5,14.35 | v86.75,15.35 86.75,14.35 | v86.75,19.85 86.75,18.85 | v86.75,24.35 86.75,23.35 | v86.75,28.85 86.75,27.85
  Top 0.2: v86.75,33.35 86.75,32.35 | v86.75,37.85 86.75,36.85 | v86.75,42.35 86.75,41.35 | v86.75,46.85 86.75,45.85 | v86.75,51.35 86.75,50.35 | v86.75,60.35 86.75,59.35 | v86.75,55.85 86.75,54.85 | v86.75,64.85 86.75,63.85 | v86.75,69.35 86.75,68.35 | v86.75,73.85 86.75,72.85 | v86.75,78.35 86.75,77.35 | v86.75,82.85 86.75,81.85
  Top 0.5: v96.35,29.1 C4.2 | v96.35,38.1 C6.2 | v96.35,47.1 C8.2 | v96.35,56.1 C10.2 | v96.35,65.1 C12.2 | v96.35,74.1 C14.2 | v96.35,83.1 C16.2 | C2.2 87.58,11.1 arc90 86.83,10.1 JP2.30
  Bottom 0.5: 16.5,77.1 28.77,77.1 29.07,77.4 29.75,77.4 | 29.75,77.4 29.93,77.4 30.23,77.1 30.75,77.1 | 30.75,77.1 43.02,77.1 43.31,77.4 44.19,77.4 | 44.19,77.4 44.48,77.1 45.25,77.1 | 45.25,77.1 57.27,77.1 57.56,77.4 58,77.4 | 58,77.4 58.44,77.4 58.73,77.1 59.25,77.1 | 59.25,77.1 71.52,77.1 71.81,77.4 72.5,77.4 | 72.5,77.4 72.69,77.4 72.98,77.1 73.5,77.1 | 73.5,77.1 85.77,77.1 86.06,77.4 86.75,77.4 | 86.75,77.4 86.94,77.4 87.23,77.1 87.75,77.1 | v86.75,78.35 86.75,77.4 | v72.5,78.35 72.5,77.4 | v58.25,78.35 58.25,77.65 58,77.4 | v44,78.35 44,77.58 44.19,77.4 | v29.75,78.35 29.75,77.4 | 16.5,68.1 28.77,68.1 29.07,68.4 29.75,68.4 | 29.75,68.4 29.93,68.4 30.23,68.1 30.75,68.1 | 30.75,68.1 43.02,68.1 43.31,68.4 44,68.4 | 44,68.4 44.19,68.4 44.48,68.1 45.25,68.1 | 45.25,68.1 57.27,68.1 57.56,68.4 58.25,68.4 | 58.25,68.4 58.44,68.4 58.73,68.1 59.5,68.1 | 59.5,68.1 71.52,68.1 71.81,68.4 72.5,68.4 | 72.5,68.4 72.69,68.4 72.98,68.1 73.75,68.1 | 73.75,68.1 85.77,68.1 86.06,68.4 86.75,68.4 | 86.75,68.4 86.94,68.4 87.23,68.1 87.75,68.1 | v86.75,69.35 86.75,68.4 | v72.5,69.35 72.5,68.4 | v58.25,69.35 58.25,68.4 | v44,69.35 44,68.4 | v29.75,69.35 29.75,68.4 | v29.75,64.85 30.75,65.85 30.75,68.1 | 16.5,59.1 28.77,59.1 29.07,59.4 29.75,59.4 | 29.75,59.4 29.93,59.4 30.23,59.1 30.75,59.1 | 30.75,59.1 43.02,59.1 43.31,59.4 44,59.4 | 44,59.4 44.19,59.4 44.48,59.1 45,59.1 | 45,59.1 57.27,59.1 57.56,59.4 58.25,59.4 | 58.25,59.4 58.44,59.4 58.73,59.1 59.25,59.1 | 59.25,59.1 71.52,59.1 71.81,59.4 72.5,59.4 | 72.5,59.4 72.69,59.4 72.98,59.1 73.5,59.1 | 73.5,59.1 85.77,59.1 86.06,59.4 86.75,59.4 | 86.75,59.4 86.94,59.4 87.23,59.1 87.75,59.1
  Bottom 0.5: 87.75,59.1 96.35,59.1 97.2,59.1 | v86.75,60.35 86.75,59.4 | v72.5,60.35 72.5,59.4 | v58.25,60.35 58.25,59.4 | v44,60.35 44,59.4 | v29.75,60.35 29.75,59.4 | 16.5,50.1 28.77,50.1 29.07,50.4 29.75,50.4 | 29.75,50.4 29.93,50.4 30.23,50.1 31,50.1 | 31,50.1 43.02,50.1 43.31,50.4 44,50.4 | 44,50.4 44.19,50.4 44.48,50.1 45.25,50.1 | 45.25,50.1 57.27,50.1 57.56,50.4 58.25,50.4 | 58.25,50.4 58.44,50.4 58.73,50.1 59.25,50.1 | 59.25,50.1 71.52,50.1 71.81,50.4 72.5,50.4 | 72.5,50.4 72.69,50.4 72.98,50.1 73.75,50.1 | 73.75,50.1 85.77,50.1 86.06,50.4 86.5,50.4 | 86.5,50.4 86.94,50.4 87.23,50.1 88,50.1 | 88,50.1 96.35,50.1 97.2,50.1 | v86.75,51.35 86.75,50.65 86.5,50.4 | v72.5,51.35 72.5,50.4 | v58.25,51.35 58.25,50.4 | v44,51.35 44,50.4 | v29.75,51.35 29.75,50.4 | 16.5,41.1 28.77,41.1 29.07,41.4 29.75,41.4 | 29.75,41.4 29.93,41.4 30.23,41.1 30.75,41.1 | 30.75,41.1 43.02,41.1 43.31,41.4 44,41.4 | 44,41.4 44.19,41.4 44.48,41.1 45.25,41.1 | 45.25,41.1 57.27,41.1 57.56,41.4 58.25,41.4 | 58.25,41.4 58.44,41.4 58.73,41.1 59.5,41.1 | 59.5,41.1 71.52,41.1 71.81,41.4 72.5,41.4 | 72.5,41.4 72.69,41.4 72.98,41.1 73.5,41.1 | 73.5,41.1 85.77,41.1 86.06,41.4 86.75,41.4 | 86.75,41.4 86.94,41.4 87.23,41.1 88,41.1 | 88,41.1 96.35,41.1 97.2,41.1 | v86.75,42.35 86.75,41.4 | v72.5,42.35 72.5,41.4 | v58.25,42.35 58.25,41.4 | v44,42.35 44,41.4 | v29.75,42.35 29.75,41.4 | 16.5,32.1 28.77,32.1 29.07,32.4 29.75,32.4 | 29.75,32.4 29.93,32.4 30.23,32.1 30.75,32.1 | 30.75,32.1 43.02,32.1 43.31,32.4 43.75,32.4 | 43.75,32.4 44.19,32.4 44.48,32.1 45,32.1 | 45,32.1 57.27,32.1 57.56,32.4 58.25,32.4 | 58.25,32.4 58.44,32.4 58.73,32.1 59.25,32.1 | 59.25,32.1 71.52,32.1 71.81,32.4 72.5,32.4
  Bottom 0.5: 72.5,32.4 72.69,32.4 72.98,32.1 73.75,32.1 | 73.75,32.1 85.77,32.1 86.06,32.4 86.75,32.4 | 86.75,32.4 86.94,32.4 87.23,32.1 88,32.1 | 88,32.1 96.35,32.1 97.2,32.1 | v86.75,33.35 86.75,32.4 | v72.5,33.35 72.5,32.4 | v58.25,33.35 58.25,32.4 | v44,33.35 44,32.65 43.75,32.4 | v29.75,33.35 29.75,32.4 | 16.5,23.1 28.77,23.1 29.07,23.4 29.75,23.4 | 29.75,23.4 29.93,23.4 30.23,23.1 31,23.1 | 31,23.1 43.02,23.1 43.31,23.4 44,23.4 | 44,23.4 44.19,23.4 44.48,23.1 45.25,23.1 | 45.25,23.1 57.27,23.1 57.56,23.4 58.25,23.4 | 58.25,23.4 58.44,23.4 58.73,23.1 59.25,23.1 | 59.25,23.1 71.52,23.1 71.81,23.4 72.5,23.4 | 72.5,23.4 72.69,23.4 72.98,23.1 73.75,23.1 | 73.75,23.1 85.77,23.1 86.06,23.4 86.75,23.4 | 86.75,23.4 86.94,23.4 87.23,23.1 88,23.1 | v86.75,24.35 86.75,23.4 | v72.5,24.35 72.5,23.4 | v58.25,24.35 58.25,23.4 | v44,24.35 44,23.4 | v29.75,24.35 29.75,23.4 | 29.75,14.1 36.25,14.1 44,14.1 | 44,14.1 58.25,14.1 | 58.25,14.1 72.5,14.1 | 72.5,14.1 86.75,14.1 | JP2.30 86.83,14.02 86.75,14.1 | v86.75,15.35 86.75,14.1 | v72.5,15.35 72.5,14.1 | v58.25,15.35 58.25,14.1 | v44,15.35 44,14.1 | v29.75,15.35 29.75,14.1 | 30.75,86.4 29.07,86.4 29.02,86.35 17,86.35 arc90 16.5,85.85 16.5,83.35 arc-90 16,82.85 v15.5,82.85 | 30.75,86.4 45.25,86.4 | 45.25,86.4 59.25,86.4 | 59.25,86.4 73.5,86.4 | 73.5,86.4 88,86.4 | v86.75,37.85 87.5,37.85 arc90 88,38.35 88,41.1 | v86.75,28.85 87.5,28.85 arc90 88,29.35 88,32.1 | v86.75,19.85 87.5,19.85 arc90 88,20.35 88,23.1 | v86.75,46.85 87.5,46.85 arc90 88,47.35 88,50.1 | v86.75,55.85 87.25,55.85 arc90 87.75,56.35 87.75,59.1 | v86.75,64.85 87.25,64.85 arc90 87.75,65.35 87.75,68.1 | v86.75,73.85 87.25,73.85 arc90 87.75,74.35 87.75,77.1
  Bottom 0.5: v86.75,82.85 87.5,82.85 arc90 88,83.35 88,86.4 | v58.25,82.85 58.75,82.85 arc90 59.25,83.35 59.25,86.4 | v58.25,73.85 58.75,73.85 arc90 59.25,74.35 59.25,77.1 | v58.25,64.85 59,64.85 arc90 59.5,65.35 59.5,68.1 | v58.25,55.85 58.75,55.85 arc90 59.25,56.35 59.25,59.1 | v58.25,46.85 58.75,46.85 arc90 59.25,47.35 59.25,50.1 | v58.25,37.85 59,37.85 arc90 59.5,38.35 59.5,41.1 | v58.25,28.85 58.75,28.85 arc90 59.25,29.35 59.25,32.1 | v72.5,28.85 73.25,28.85 arc90 73.75,29.35 73.75,32.1 | v72.5,19.85 73.25,19.85 arc90 73.75,20.35 73.75,23.1 | v72.5,37.85 73,37.85 arc90 73.5,38.35 73.5,41.1 | v72.5,46.85 73.25,46.85 arc90 73.75,47.35 73.75,50.1 | v72.5,55.85 73,55.85 arc90 73.5,56.35 73.5,59.1 | v72.5,64.85 73.25,64.85 arc90 73.75,65.35 73.75,68.1 | v72.5,73.85 73,73.85 arc90 73.5,74.35 73.5,77.1 | v72.5,82.85 73,82.85 arc90 73.5,83.35 73.5,86.4 | v58.25,19.85 58.75,19.85 arc90 59.25,20.35 59.25,23.1 | v44,82.85 44.75,82.85 arc90 45.25,83.35 45.25,86.4 | v44,73.85 44.75,73.85 arc90 45.25,74.35 45.25,77.1 | v44,64.85 44.75,64.85 arc90 45.25,65.35 45.25,68.1 | v44,55.85 44.5,55.85 arc90 45,56.35 45,59.1 | v44,46.85 44.75,46.85 arc90 45.25,47.35 45.25,50.1 | v44,37.85 44.75,37.85 arc90 45.25,38.35 45.25,41.1 | v44,28.85 44.5,28.85 arc90 45,29.35 45,32.1 | v44,19.85 44.75,19.85 arc90 45.25,20.35 45.25,23.1 | v29.75,19.85 30.5,19.85 arc90 31,20.35 31,23.1 | v29.75,28.85 30.25,28.85 arc90 30.75,29.35 30.75,32.1 | v29.75,37.85 30.25,37.85 arc90 30.75,38.35 30.75,41.1 | v29.75,46.85 30.5,46.85 arc90 31,47.35 31,50.1 | v29.75,55.85 30.25,55.85 arc90 30.75,56.35 30.75,59.1 | v29.75,73.85 30.25,73.85 arc90 30.75,74.35 30.75,77.1
  Bottom 0.5: v29.75,82.85 30.25,82.85 arc90 30.75,83.35 30.75,86.4 | v15.5,78.35 16,78.35 arc-90 16.5,77.85 16.5,77.1 | v15.5,73.85 16,73.85 arc90 16.5,74.35 16.5,77.1 | v15.5,69.35 16,69.35 arc-90 16.5,68.85 16.5,68.1 | v15.5,64.85 16,64.85 arc90 16.5,65.35 16.5,68.1 | v15.5,55.85 16,55.85 arc90 16.5,56.35 16.5,59.1 | v15.5,60.35 16,60.35 arc-90 16.5,59.85 16.5,59.1 | v15.5,51.35 16,51.35 arc-90 16.5,50.85 16.5,50.1 | v15.5,46.85 16,46.85 arc90 16.5,47.35 16.5,50.1 | v15.5,42.35 16,42.35 arc-90 16.5,41.85 16.5,41.1 | v15.5,37.85 16,37.85 arc90 16.5,38.35 16.5,41.1 | v15.5,28.85 16,28.85 arc90 16.5,29.35 16.5,32.1 | v15.5,33.35 16,33.35 arc-90 16.5,32.85 16.5,32.1 | v15.5,24.35 16,24.35 arc-90 16.5,23.85 16.5,23.1 | v15.5,19.85 16,19.85 arc90 16.5,20.35 16.5,23.1 | v15.5,15.35 15.5,14.6 arc90 16,14.1 29.75,14.1 | 86.75,14.1 89.5,14.1 91,14.1 arc90 91.5,14.6 91.5,23.1 | 97.2,29.1 97.2,32.1 | 97.2,32.1 97.2,35.5 97.2,38.1 | 97.2,38.1 97.2,41.1 | 97.2,41.1 97.2,44.7 97.2,47.1 | 97.2,47.1 97.2,50.1 | 97.2,50.1 97.2,53.5 97.2,56.1 | 97.2,56.1 97.2,59.1 | 97.2,59.1 97.2,62.5 97.2,65.1 | 97.2,65.1 97.2,68.1 | 97.2,68.1 97.2,71.7 97.2,74.1 | 97.2,74.1 97.2,76.1 97.2,77.1 | 97.2,77.1 97.2,80.5 97.2,83.1 | 97.2,83.1 97.2,85.1 97.2,85.9 arc90 96.7,86.4 88,86.4 | 88,23.1 91.5,23.1 | 91.5,23.1 93.75,23.1 arc90 94.25,23.6 94.25,25.85 arc-90 94.75,26.35 96.7,26.35 arc90 97.2,26.85 97.2,29.1 | 87.75,77.1 97.2,77.1 | 87.75,68.1 97.2,68.1 | v96.35,83.1 97.2,83.1 | v96.35,74.1 97.2,74.1 | v96.35,65.1 97.2,65.1 | v96.35,56.1 97.2,56.1 | v96.35,47.1 97.2,47.1 | v96.35,38.1 97.2,38.1 | v96.35,29.1 97.2,29.1
N$1  (via drill 0.7)  (95 unrouted)
  Top 0.2: Q1.1 12.5,15.35 11,15.35 v11,15.1 v11,16.35 v11,17.6 | Q5.1 12.5,19.85 11,19.85 v11,19.6 v11,20.85 v11,22.1 | Q9.1 12.5,24.35 11,24.35 v11,24.1 v11,25.35 v11,26.6 | Q13.1 12.5,28.85 11,28.85 v11,28.6 v11,29.85 v11,31.1 | Q17.1 12.5,33.35 11,33.35 v11,33.1 v11,34.35 v11,35.6 | Q21.1 12.5,37.85 11,37.85 v11,37.6 v11,38.85 v11,40.1 | Q25.1 12.5,42.35 11,42.35 v11,42.1 v11,43.35 v11,44.6 | Q29.1 12.5,46.85 11,46.85 v11,46.6 v11,47.85 v11,49.1 | Q33.1 12.5,51.35 11,51.35 v11,51.1 v11,52.35 v11,53.6 | Q37.1 12.5,55.85 11,55.85 v11,55.6 v11,56.85 v11,58.1 | Q41.1 12.5,60.35 11,60.35 v11,60.1 v11,61.35 v11,62.6 | Q45.1 12.5,64.85 11,64.85 v11,64.6 v11,65.85 v11,67.1 | Q49.1 12.5,69.35 11,69.35 v11,69.1 v11,70.35 v11,71.6 | Q53.1 12.5,73.85 11,73.85 v11,73.6 v11,74.85 v11,76.1 | Q57.1 12.5,78.35 11,78.35 v11,78.1 v11,79.35 v11,80.6 | Q61.1 12.5,82.85 11,82.85 v11,82.6 v11,83.85 v11,85.1 | Q65.1 26.75,15.35 25.25,15.35 v25.25,15.1 v25.25,16.35 v25.25,17.6 | Q67.1 26.75,19.85 25.25,19.85 v25.25,19.6 v25.25,20.85 v25.25,22.1 | Q69.1 26.75,24.35 25.25,24.35 v25.25,24.1 v25.25,25.35 v25.25,26.6 | Q71.1 26.75,28.85 25.25,28.85 v25.25,28.6 v25.25,29.85 v25.25,31.1 | Q73.1 26.75,33.35 25.25,33.35 v25.25,33.1 v25.25,34.35 v25.25,35.6 | Q75.1 26.75,37.85 25.25,37.85 v25.25,37.6 v25.25,38.85 v25.25,40.1 | Q77.1 26.75,42.35 25.25,42.35 v25.25,42.1 v25.25,43.35 v25.25,44.6 | Q79.1 26.75,46.85 25.25,46.85 v25.25,46.6 v25.25,47.85 v25.25,49.1 | Q81.1 26.75,51.35 25.25,51.35 v25.25,51.1 v25.25,52.35 v25.25,53.6 | Q83.1 26.75,55.85 25.25,55.85 v25.25,55.6 v25.25,56.85 v25.25,58.1
  Top 0.2: Q85.1 26.75,60.35 25.25,60.35 v25.25,60.1 v25.25,61.35 v25.25,62.6 | Q87.1 26.75,64.85 25.25,64.85 v25.25,64.6 v25.25,65.85 v25.25,67.1 | Q89.1 26.75,69.35 25.25,69.35 v25.25,69.1 v25.25,70.35 v25.25,71.6 | Q91.1 26.75,73.85 25.25,73.85 v25.25,73.6 v25.25,74.85 v25.25,76.1 | Q93.1 26.75,78.35 25.25,78.35 v25.25,78.1 v25.25,79.35 v25.25,80.6 | Q95.1 26.75,82.85 25.25,82.85 v25.25,82.6 v25.25,83.85 v25.25,85.1 | Q129.1 41,15.35 39.5,15.35 v39.5,15.1 v39.5,16.35 v39.5,17.6 | Q131.1 41,19.85 39.5,19.85 v39.5,19.6 v39.5,20.85 v39.5,22.1 | Q133.1 41,24.35 39.5,24.35 v39.5,24.1 v39.5,25.35 v39.5,26.6 | Q135.1 41,28.85 39.5,28.85 v39.5,28.6 v39.5,29.85 v39.5,31.1 | Q137.1 41,33.35 39.5,33.35 v39.5,33.1 v39.5,34.35 v39.5,35.6 | Q139.1 41,37.85 39.5,37.85 v39.5,37.6 v39.5,38.85 v39.5,40.1 | Q141.1 41,42.35 39.5,42.35 v39.5,42.1 v39.5,43.35 v39.5,44.6 | Q143.1 41,46.85 39.5,46.85 v39.5,46.6 v39.5,47.85 v39.5,49.1 | Q145.1 41,51.35 39.5,51.35 v39.5,51.1 v39.5,52.35 v39.5,53.6 | Q147.1 41,55.85 39.5,55.85 v39.5,55.6 v39.5,56.85 v39.5,58.1 | Q149.1 41,60.35 39.5,60.35 v39.5,60.1 v39.5,61.35 v39.5,62.6 | Q151.1 41,64.85 39.5,64.85 v39.5,64.6 v39.5,65.85 v39.5,67.1 | Q153.1 41,69.35 39.5,69.35 v39.5,69.1 v39.5,70.35 v39.5,71.6 | Q155.1 41,73.85 39.5,73.85 v39.5,73.6 v39.5,74.85 v39.5,76.1 | Q157.1 41,78.35 39.5,78.35 v39.5,78.1 v39.5,79.35 v39.5,80.6 | Q159.1 41,82.85 39.5,82.85 v39.5,82.6 v39.5,83.85 v39.5,85.1 | Q193.1 55.25,15.35 53.75,15.35 v53.75,15.1 v53.75,16.35 v53.75,17.6 | Q195.1 55.25,19.85 53.75,19.85 v53.75,19.6 v53.75,20.85 v53.75,22.1 | Q197.1 55.25,24.35 53.75,24.35 v53.75,24.1 v53.75,25.35 v53.75,26.6
  Top 0.2: Q199.1 55.25,28.85 53.75,28.85 v53.75,28.6 v53.75,29.85 v53.75,31.1 | Q201.1 55.25,33.35 53.75,33.35 v53.75,33.1 v53.75,34.35 v53.75,35.6 | Q203.1 55.25,37.85 53.75,37.85 v53.75,37.6 v53.75,38.85 v53.75,40.1 | Q205.1 55.25,42.35 53.75,42.35 v53.75,42.1 v53.75,43.35 v53.75,44.6 | Q207.1 55.25,46.85 53.75,46.85 v53.75,46.6 v53.75,47.85 v53.75,49.1 | Q209.1 55.25,51.35 53.75,51.35 v53.75,51.1 v53.75,52.35 v53.75,53.6 | Q211.1 55.25,55.85 53.75,55.85 v53.75,55.6 v53.75,56.85 v53.75,58.1 | Q213.1 55.25,60.35 53.75,60.35 v53.75,60.1 v53.75,61.35 v53.75,62.6 | Q215.1 55.25,64.85 53.75,64.85 v53.75,64.6 v53.75,65.85 v53.75,67.1 | Q217.1 55.25,69.35 53.75,69.35 v53.75,69.1 v53.75,70.35 v53.75,71.6 | Q219.1 55.25,73.85 53.75,73.85 v53.75,73.6 v53.75,74.85 v53.75,76.1 | Q221.1 55.25,78.35 53.75,78.35 v53.75,78.1 v53.75,79.35 v53.75,80.6 | Q223.1 55.25,82.85 53.75,82.85 v53.75,82.6 v53.75,83.85 v53.75,85.1 | Q257.1 69.5,15.35 68,15.35 v68,15.1 v68,16.35 v68,17.6 | Q259.1 69.5,19.85 68,19.85 v68,19.6 v68,20.85 v68,22.1 | Q261.1 69.5,24.35 68,24.35 v68,24.1 v68,25.35 v68,26.6 | Q263.1 69.5,28.85 68,28.85 v68,28.6 v68,29.85 v68,31.1 | Q265.1 69.5,33.35 68,33.35 v68,33.1 v68,34.35 v68,35.6 | Q267.1 69.5,37.85 68,37.85 v68,37.6 v68,38.85 v68,40.1 | Q269.1 69.5,42.35 68,42.35 v68,42.1 v68,43.35 v68,44.6 | Q271.1 69.5,46.85 68,46.85 v68,46.6 v68,47.85 v68,49.1 | Q273.1 69.5,51.35 68,51.35 v68,51.1 v68,52.35 v68,53.6 | Q275.1 69.5,55.85 68,55.85 v68,55.6 v68,56.85 v68,58.1 | Q277.1 69.5,60.35 68,60.35 v68,60.1 v68,61.35 v68,62.6 | Q279.1 69.5,64.85 68,64.85 v68,64.6 v68,65.85 v68,67.1
  Top 0.2: Q281.1 69.5,69.35 68,69.35 v68,69.1 v68,70.35 v68,71.6 | Q283.1 69.5,73.85 68,73.85 v68,73.6 v68,74.85 v68,76.1 | Q285.1 69.5,78.35 68,78.35 v68,78.1 v68,79.35 v68,80.6 | Q287.1 69.5,82.85 68,82.85 v68,82.6 v68,83.85 v68,85.1 | Q321.1 83.75,15.35 82.25,15.35 v82.25,15.1 v82.25,16.35 v82.25,17.6 | Q323.1 83.75,19.85 82.25,19.85 v82.25,19.6 v82.25,20.85 v82.25,22.1 | Q325.1 83.75,24.35 82.25,24.35 v82.25,24.1 v82.25,25.35 v82.25,26.6 | Q327.1 83.75,28.85 82.25,28.85 v82.25,28.6 v82.25,29.85 v82.25,31.1 | Q329.1 83.75,33.35 82.25,33.35 v82.25,33.1 v82.25,34.35 v82.25,35.6 | Q331.1 83.75,37.85 82.25,37.85 v82.25,37.6 v82.25,38.85 v82.25,40.1 | Q333.1 83.75,42.35 82.25,42.35 v82.25,42.1 v82.25,43.35 v82.25,44.6 | Q335.1 83.75,46.85 82.25,46.85 v82.25,46.6 v82.25,47.85 v82.25,49.1 | Q337.1 83.75,51.35 82.25,51.35 v82.25,51.1 v82.25,52.35 v82.25,53.6 | Q339.1 83.75,55.85 82.25,55.85 v82.25,55.6 v82.25,56.85 v82.25,58.1 | Q341.1 83.75,60.35 82.25,60.35 v82.25,60.1 v82.25,61.35 v82.25,62.6 | Q343.1 83.75,64.85 82.25,64.85 v82.25,64.6 v82.25,65.85 v82.25,67.1 | Q345.1 83.75,69.35 82.25,69.35 v82.25,69.1 v82.25,70.35 v82.25,71.6 | Q347.1 83.75,73.85 82.25,73.85 v82.25,73.6 v82.25,74.85 v82.25,76.1 | Q349.1 83.75,78.35 82.25,78.35 v82.25,78.1 v82.25,79.35 v82.25,80.6 | Q351.1 83.75,82.85 82.25,82.85 v82.25,82.6 v82.25,83.85 v82.25,85.1
N$2  (via drill 0.7)  (104 unrouted)
  Top 0.2: v9.5,15.1 v9.5,16.35 v9.5,17.6 9.5,18.1 arc-90 10,18.6 11.75,18.6 arc-90 12.25,18.1 12.25,17.1 arc90 12.75,16.6 16.05,16.6 arc-90 16.55,16.1 Q2.1 | v9.5,19.6 v9.5,20.85 9.5,22.6 arc-90 10,23.1 11.75,23.1 arc-90 12.25,22.6 12.25,21.6 arc90 12.75,21.1 16.05,21.1 arc-90 16.55,20.6 Q6.1 | v9.5,24.1 v9.5,25.35 v9.5,26.6 9.5,27.1 arc-90 10,27.6 11.75,27.6 arc-90 12.25,27.1 12.25,26.1 arc90 12.75,25.6 16.05,25.6 arc-90 16.55,25.1 Q10.1 | v9.5,28.6 v9.5,29.85 v9.5,31.1 9.5,31.6 arc-90 10,32.1 11.75,32.1 arc-90 12.25,31.6 12.25,30.6 arc90 12.75,30.1 16.05,30.1 arc-90 16.55,29.6 Q14.1 | v9.5,33.1 v9.5,34.35 v9.5,35.6 9.5,36.1 arc-90 10,36.6 11.75,36.6 arc-90 12.25,36.1 12.25,35.1 arc90 12.75,34.6 16.05,34.6 arc-90 16.55,34.1 Q18.1 | v9.5,37.6 v9.5,38.85 v9.5,40.1 9.5,40.6 arc-90 10,41.1 11.75,41.1 arc-90 12.25,40.6 12.25,39.6 arc90 12.75,39.1 16.05,39.1 arc-90 16.55,38.6 Q22.1 | v9.5,42.1 v9.5,43.35 v9.5,44.6 9.5,45.1 arc-90 10,45.6 11.75,45.6 arc-90 12.25,45.1 12.25,44.1 arc90 12.75,43.6 16.05,43.6 arc-90 16.55,43.1 Q26.1 | v9.5,46.6 v9.5,47.85 v9.5,49.1 9.5,49.6 arc-90 10,50.1 11.75,50.1 arc-90 12.25,49.6 12.25,48.6 arc90 12.75,48.1 16.05,48.1 arc-90 16.55,47.6 Q30.1 | v9.5,51.1 v9.5,52.35 v9.5,53.6 9.5,54.1 arc-90 10,54.6 11.75,54.6 arc-90 12.25,54.1 12.25,53.1 arc90 12.75,52.6 16.05,52.6 arc-90 16.55,52.1 Q34.1 | v9.5,55.6 v9.5,56.85 v9.5,58.1 9.5,58.6 arc-90 10,59.1 11.75,59.1 arc-90 12.25,58.6 12.25,57.6 arc90 12.75,57.1 16.05,57.1 arc-90 16.55,56.6 Q38.1 | v9.5,60.1 v9.5,61.35 v9.5,62.6 9.5,63.1 arc-90 10,63.6 11.75,63.6 arc-90 12.25,63.1 12.25,62.1 arc90 12.75,61.6 16.05,61.6 arc-90 16.55,61.1 Q42.1
  Top 0.2: v9.5,64.6 v9.5,65.85 9.5,67.6 arc-90 10,68.1 11.75,68.1 arc-90 12.25,67.6 12.25,66.6 arc90 12.75,66.1 16.05,66.1 arc-90 16.55,65.6 Q46.1 | v9.5,69.1 v9.5,70.35 v9.5,71.6 9.5,72.1 arc-90 10,72.6 11.75,72.6 arc-90 12.25,72.1 12.25,71.1 arc90 12.75,70.6 16.05,70.6 arc-90 16.55,70.1 Q50.1 | v9.5,73.6 v9.5,74.85 v9.5,76.1 9.5,76.6 arc-90 10,77.1 11.75,77.1 arc-90 12.25,76.6 12.25,75.6 arc90 12.75,75.1 16.05,75.1 arc-90 16.55,74.6 Q54.1 | v9.5,78.1 v9.5,79.35 v9.5,80.6 9.5,81.1 arc-90 10,81.6 11.75,81.6 arc-90 12.25,81.1 12.25,80.1 arc90 12.75,79.6 16.05,79.6 arc-90 16.55,79.1 Q58.1 | v9.5,82.6 v9.5,83.85 v9.5,85.1 9.5,85.6 arc-90 10,86.1 11.75,86.1 arc-90 12.25,85.6 12.25,84.6 arc90 12.75,84.1 16.05,84.1 arc-90 16.55,83.6 Q62.1 | v23.75,15.1 v23.75,16.35 v23.75,17.6 23.75,18.1 arc-90 24.25,18.6 26,18.6 arc-90 26.5,18.1 26.5,17.1 arc90 27,16.6 30.3,16.6 arc-90 30.8,16.1 Q66.1 | v23.75,19.6 v23.75,20.85 v23.75,22.1 23.75,22.6 arc-90 24.25,23.1 26,23.1 arc-90 26.5,22.6 26.5,21.6 arc90 27,21.1 30.3,21.1 arc-90 30.8,20.6 Q68.1 | v23.75,24.1 v23.75,25.35 v23.75,26.6 23.75,27.1 arc-90 24.25,27.6 26,27.6 arc-90 26.5,27.1 26.5,26.1 arc90 27,25.6 30.3,25.6 arc-90 30.8,25.1 Q70.1 | v23.75,28.6 v23.75,29.85 v23.75,31.1 23.75,31.6 arc-90 24.25,32.1 26,32.1 arc-90 26.5,31.6 26.5,30.6 arc90 27,30.1 30.3,30.1 arc-90 30.8,29.6 Q72.1 | v23.75,33.1 v23.75,34.35 v23.75,35.6 23.75,36.1 arc-90 24.25,36.6 26,36.6 arc-90 26.5,36.1 26.5,35.1 arc90 27,34.6 30.3,34.6 arc-90 30.8,34.1 Q74.1 | v23.75,37.6 v23.75,38.85 v23.75,40.1 23.75,40.6 arc-90 24.25,41.1 26,41.1 arc-90 26.5,40.6 26.5,39.6 arc90 27,39.1 30.3,39.1 arc-90 30.8,38.6 Q76.1
  Top 0.2: v23.75,42.1 v23.75,43.35 v23.75,44.6 23.75,45.1 arc-90 24.25,45.6 26,45.6 arc-90 26.5,45.1 26.5,44.1 arc90 27,43.6 30.3,43.6 arc-90 30.8,43.1 Q78.1 | v23.75,46.6 v23.75,47.85 v23.75,49.1 23.75,49.6 arc-90 24.25,50.1 26,50.1 arc-90 26.5,49.6 26.5,48.6 arc90 27,48.1 30.3,48.1 arc-90 30.8,47.6 Q80.1 | v23.75,51.1 v23.75,52.35 v23.75,53.6 23.75,54.1 arc-90 24.25,54.6 26,54.6 arc-90 26.5,54.1 26.5,53.1 arc90 27,52.6 30.3,52.6 arc-90 30.8,52.1 Q82.1 | v23.75,55.6 v23.75,56.85 v23.75,58.1 23.75,58.6 arc-90 24.25,59.1 26,59.1 arc-90 26.5,58.6 26.5,57.6 arc90 27,57.1 30.3,57.1 arc-90 30.8,56.6 Q84.1 | v23.75,60.1 v23.75,61.35 v23.75,62.6 23.75,63.1 arc-90 24.25,63.6 26,63.6 arc-90 26.5,63.1 26.5,62.1 arc90 27,61.6 30.3,61.6 arc-90 30.8,61.1 Q86.1 | v23.75,64.6 v23.75,65.85 v23.75,67.1 23.75,67.6 arc-90 24.25,68.1 26,68.1 arc-90 26.5,67.6 26.5,66.6 arc90 27,66.1 30.3,66.1 arc-90 30.8,65.6 Q88.1 | v23.75,69.1 v23.75,70.35 v23.75,71.6 23.75,72.1 arc-90 24.25,72.6 26,72.6 arc-90 26.5,72.1 26.5,71.1 arc90 27,70.6 30.3,70.6 arc-90 30.8,70.1 Q90.1 | v23.75,73.6 v23.75,74.85 v23.75,76.1 23.75,76.6 arc-90 24.25,77.1 26,77.1 arc-90 26.5,76.6 26.5,75.6 arc90 27,75.1 30.3,75.1 arc-90 30.8,74.6 Q92.1 | v23.75,78.1 v23.75,79.35 v23.75,80.6 23.75,81.1 arc-90 24.25,81.6 26,81.6 arc-90 26.5,81.1 26.5,80.1 arc90 27,79.6 30.3,79.6 arc-90 30.8,79.1 Q94.1 | v23.75,82.6 v23.75,83.85 23.75,85.6 arc-90 24.25,86.1 26,86.1 arc-90 26.5,85.6 26.5,84.6 arc90 27,84.1 30.3,84.1 arc-90 30.8,83.6 Q96.1 | v38,15.1 v38,16.35 v38,17.6 38,18.1 arc-90 38.5,18.6 40.25,18.6 arc-90 40.75,18.1 40.75,17.1 arc90 41.25,16.6 44.55,16.6 arc-90 45.05,16.1 Q130.1
  Top 0.2: v38,19.6 v38,20.85 v38,22.1 38,22.6 arc-90 38.5,23.1 40.25,23.1 arc-90 40.75,22.6 40.75,21.6 arc90 41.25,21.1 44.55,21.1 arc-90 45.05,20.6 Q132.1 | v38,24.1 v38,25.35 v38,26.6 38,27.1 arc-90 38.5,27.6 40.25,27.6 arc-90 40.75,27.1 40.75,26.1 arc90 41.25,25.6 44.55,25.6 arc-90 45.05,25.1 Q134.1 | v38,28.6 v38,29.85 v38,31.1 38,31.6 arc-90 38.5,32.1 40.25,32.1 arc-90 40.75,31.6 40.75,30.6 arc90 41.25,30.1 44.55,30.1 arc-90 45.05,29.6 Q136.1 | v38,33.1 v38,34.35 v38,35.6 38,36.1 arc-90 38.5,36.6 40.25,36.6 arc-90 40.75,36.1 40.75,35.1 arc90 41.25,34.6 44.55,34.6 arc-90 45.05,34.1 Q138.1 | v38,37.6 v38,38.85 v38,40.1 38,40.6 arc-90 38.5,41.1 40.25,41.1 arc-90 40.75,40.6 40.75,39.6 arc90 41.25,39.1 44.55,39.1 arc-90 45.05,38.6 Q140.1 | v38,42.1 v38,43.35 v38,44.6 38,45.1 arc-90 38.5,45.6 40.25,45.6 arc-90 40.75,45.1 40.75,44.1 arc90 41.25,43.6 44.55,43.6 arc-90 45.05,43.1 Q142.1 | v38,46.6 v38,47.85 v38,49.1 38,49.6 arc-90 38.5,50.1 40.25,50.1 arc-90 40.75,49.6 40.75,48.6 arc90 41.25,48.1 44.55,48.1 arc-90 45.05,47.6 Q144.1 | v38,51.1 v38,52.35 38,54.1 arc-90 38.5,54.6 40.25,54.6 arc-90 40.75,54.1 40.75,53.1 arc90 41.25,52.6 44.55,52.6 arc-90 45.05,52.1 Q146.1 | v38,55.6 v38,56.85 v38,58.1 38,58.6 arc-90 38.5,59.1 40.25,59.1 arc-90 40.75,58.6 40.75,57.6 arc90 41.25,57.1 44.55,57.1 arc-90 45.05,56.6 Q148.1 | v38,60.1 v38,61.35 v38,62.6 38,63.1 arc-90 38.5,63.6 40.25,63.6 arc-90 40.75,63.1 40.75,62.1 arc90 41.25,61.6 44.55,61.6 arc-90 45.05,61.1 Q150.1 | v38,64.6 v38,65.85 v38,67.1 38,67.6 arc-90 38.5,68.1 40.25,68.1 arc-90 40.75,67.6 40.75,66.6 arc90 41.25,66.1 44.55,66.1 arc-90 45.05,65.6 Q152.1
  Top 0.2: v38,69.1 v38,70.35 v38,71.6 38,72.1 arc-90 38.5,72.6 40.25,72.6 arc-90 40.75,72.1 40.75,71.1 arc90 41.25,70.6 44.55,70.6 arc-90 45.05,70.1 Q154.1 | v38,73.6 v38,74.85 v38,76.1 38,76.6 arc-90 38.5,77.1 40.25,77.1 arc-90 40.75,76.6 40.75,75.6 arc90 41.25,75.1 44.55,75.1 arc-90 45.05,74.6 Q156.1 | v38,78.1 v38,79.35 v38,80.6 38,81.1 arc-90 38.5,81.6 40.25,81.6 arc-90 40.75,81.1 40.75,80.1 arc90 41.25,79.6 44.55,79.6 arc-90 45.05,79.1 Q158.1 | v38,82.6 v38,83.85 v38,85.1 38,85.6 arc-90 38.5,86.1 40.25,86.1 arc-90 40.75,85.6 40.75,84.6 arc90 41.25,84.1 44.55,84.1 arc-90 45.05,83.6 Q160.1 | v52.25,15.1 v52.25,16.35 v52.25,17.6 52.25,18.1 arc-90 52.75,18.6 54.5,18.6 arc-90 55,18.1 55,17.1 arc90 55.5,16.6 58.8,16.6 arc-90 59.3,16.1 Q194.1 | v52.25,19.6 v52.25,20.85 v52.25,22.1 52.25,22.6 arc-90 52.75,23.1 54.5,23.1 arc-90 55,22.6 55,21.6 arc90 55.5,21.1 58.8,21.1 arc-90 59.3,20.6 Q196.1 | v52.25,24.1 v52.25,25.35 v52.25,26.6 52.25,27.1 arc-90 52.75,27.6 54.5,27.6 arc-90 55,27.1 55,26.1 arc90 55.5,25.6 58.8,25.6 arc-90 59.3,25.1 Q198.1 | v52.25,28.6 v52.25,29.85 v52.25,31.1 52.25,31.6 arc-90 52.75,32.1 54.5,32.1 arc-90 55,31.6 55,30.6 arc90 55.5,30.1 58.8,30.1 arc-90 59.3,29.6 Q200.1 | v52.25,33.1 v52.25,34.35 v52.25,35.6 52.25,36.1 arc-90 52.75,36.6 54.5,36.6 arc-90 55,36.1 55,35.1 arc90 55.5,34.6 58.8,34.6 arc-90 59.3,34.1 Q202.1 | v52.25,37.6 v52.25,38.85 v52.25,40.1 52.25,40.6 arc-90 52.75,41.1 54.5,41.1 arc-90 55,40.6 55,39.6 arc90 55.5,39.1 58.8,39.1 arc-90 59.3,38.6 Q204.1 | v52.25,42.1 v52.25,43.35 v52.25,44.6 52.25,45.1 arc-90 52.75,45.6 54.5,45.6 arc-90 55,45.1 55,44.1 arc90 55.5,43.6 58.8,43.6 arc-90 59.3,43.1 Q206.1